# Altium project PlacaCircuito.PrjPCB
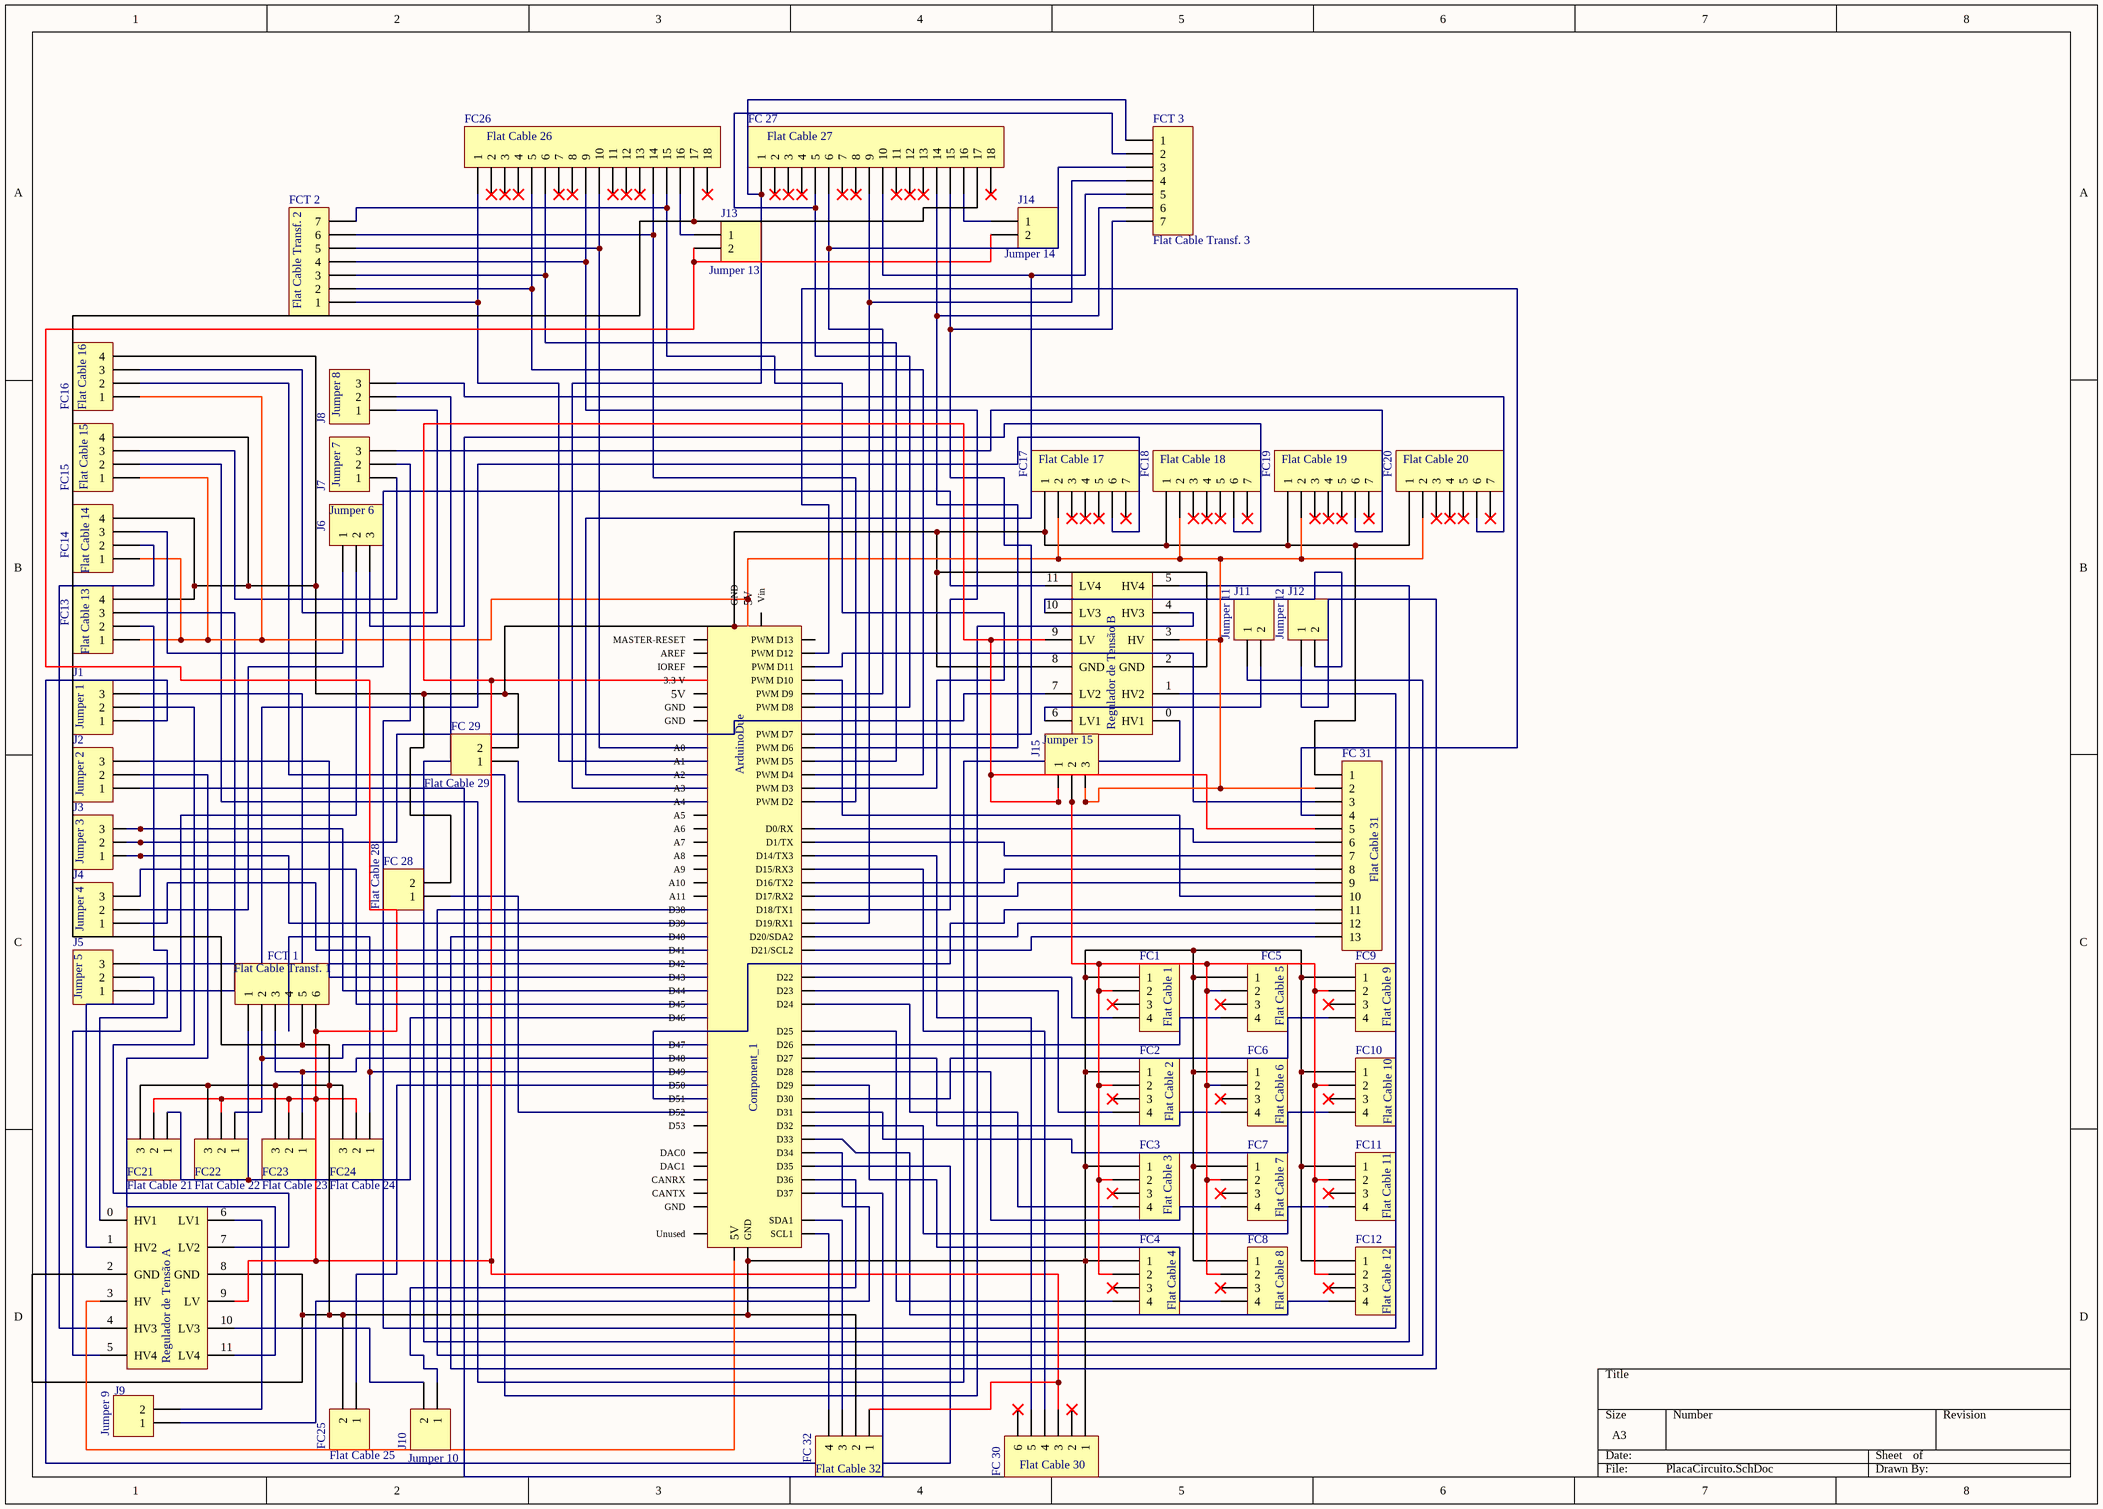
[diagram p0: PlacaCircuito.SchDoc]
1 sheet, 53 parts. Net scope: global (net labels, ports and power ports of the same name join across sheets).
Board file: PlacaCircuito.PcbDoc

## Sheet PlacaCircuito.SchDoc
size A3; PageSetup: Record=PageOptions|CenterHorizontal=True|CenterVertical=True|PrintScale=1.00|XCorrection=1.00|YCorrection=1.00|PrintKind=1|BorderSize=5000000|LeftOffset=0|BottomOffset=0|Orientation=2|PaperLength=1000|PaperWidth=1000|Scale=100|PaperSource=7|PrintQuality=-4|MediaType=1|DitherType=10|PaperKind=A3|PrintScaleMode=1

### Parts
ArduinoDue  Component_1  [Arduino]
FC1  Flat Cable 1  [HDR1X4]
FC2  Flat Cable 2  [HDR1X4]
FC3  Flat Cable 3  [HDR1X4]
FC4  Flat Cable 4  [HDR1X4]
FC5  Flat Cable 5  [HDR1X4]
FC6  Flat Cable 6  [HDR1X4]
FC7  Flat Cable 7  [HDR1X4]
FC8  Flat Cable 8  [HDR1X4]
FC9  Flat Cable 9  [HDR1X4]
FC10  Flat Cable 10  [HDR1X4]
FC11  Flat Cable 11  [HDR1X4]
FC12  Flat Cable 12  [HDR1X4]
FC13  Flat Cable 13  [HDR1X4]
FC14  Flat Cable 14  [HDR1X4]
FC15  Flat Cable 15  [HDR1X4]
FC16  Flat Cable 16  [HDR1X4]
FC17  Flat Cable 17  [HDR1X7]
FC18  Flat Cable 18  [HDR1X7]
FC19  Flat Cable 19  [HDR1X7]
FC20  Flat Cable 20  [HDR1X7]
FC21  Flat Cable 21  [HDR1X3]
FC22  Flat Cable 22  [HDR1X3]
FC23  Flat Cable 23  [HDR1X3]
FC24  Flat Cable 24  [HDR1X3]
FC25  Flat Cable 25  [HDR1X2]
FC26  Flat Cable 26  [HDR1X18]
FC_27  Flat Cable 27  [HDR1X18]
FC_28  Flat Cable 28  [HDR1X2]
FC_29  Flat Cable 29  [HDR1X2]
FC_30  Flat Cable 30  [HDR1X6]
FC_31  Flat Cable 31  [HDR1X13]
FC_32  Flat Cable 32  [HDR1X4]
FCT_1  Flat Cable Transf. 1  [HDR1X6]
FCT_2  Flat Cable Transf. 2  [HDR1X7]
FCT_3  Flat Cable Transf. 3  [HDR1X7]
J1  Jumper 1  [HDR1X3]
J2  Jumper 2  [HDR1X3]
J3  Jumper 3  [HDR1X3]
J4  Jumper 4  [HDR1X3]
J5  Jumper 5  [HDR1X3]
J6  Jumper 6  [HDR1X3]
J7  Jumper 7  [HDR1X3]
J8  Jumper 8  [HDR1X3]
J9  Jumper 9  [HDR1X2]
J10  Jumper 10  [HDR1X2]
J11  Jumper 11  [HDR1X2]
J12  Jumper 12  [HDR1X2]
J13  Jumper 13  [HDR1X2]
J14  Jumper 14  [HDR1X2]
J15  Jumper 15  [HDR1X3]
Regulador_de_Tensão_A  Regulador de Tensão A  [PCBComponent_1]
Regulador_de_Tensão_B  Regulador de Tensão B  [PCBComponent_1]

### Nets
NetArduinoDue_0: ArduinoDue.0(D0/RX) FC_31.6
NetArduinoDue_1: ArduinoDue.1(D1/TX) FC_31.7
NetArduinoDue_2: ArduinoDue.2(PWM_D2) FC26.14 FCT_2.6
NetArduinoDue_3: ArduinoDue.3(PWM_D3) FC26.15 FCT_2.7
NetArduinoDue_4: ArduinoDue.4(PWM_D4) FC26.5 FCT_2.2
NetArduinoDue_5: ArduinoDue.5(PWM_D5) FC26.6 FCT_2.3
NetArduinoDue_6: ArduinoDue.6(PWM_D6) FC_27.14 FCT_3.6
NetArduinoDue_7: ArduinoDue.7(PWM_D7) FC_27.15 FCT_3.7
NetArduinoDue_8: ArduinoDue.8(PWM_D8) FC_27.5 FCT_3.2
NetArduinoDue_9: ArduinoDue.9(PWM_D9) FC_27.6 FCT_3.3
NetArduinoDue_10: ArduinoDue.10(PWM_D10) FC_31.10
NetArduinoDue_11: ArduinoDue.11(PWM_D11) FC_31.3
NetArduinoDue_12: ArduinoDue.12(PWM_D12) FC_31.4
NetArduinoDue_14: ArduinoDue.14(D14/TX3) FC_30.5
NetArduinoDue_15: ArduinoDue.15(D15/RX3) FC_30.4
NetArduinoDue_16: ArduinoDue.16(D16/TX2) FC_31.8
NetArduinoDue_17: ArduinoDue.17(D17/RX2) FC_31.9
NetArduinoDue_18: ArduinoDue.18(D18/TX1) FC26.9 FCT_2.4
NetArduinoDue_19: ArduinoDue.19(D19/RX1) FC_27.9 FCT_3.4
NetArduinoDue_20: ArduinoDue.20(D20/SDA2) FC_31.12
NetArduinoDue_21: ArduinoDue.21(D21/SCL2) FC_31.13
NetArduinoDue_22: ArduinoDue.22(D22) FC1.4
NetArduinoDue_23: ArduinoDue.23(D23) FC2.4
NetArduinoDue_24: ArduinoDue.24(D24) FC3.4
NetArduinoDue_25: ArduinoDue.25(D25) FC4.4
NetArduinoDue_26: ArduinoDue.26(D26) FC5.4
NetArduinoDue_27: ArduinoDue.27(D27) FC6.4
NetArduinoDue_28: ArduinoDue.28(D28) FC7.4
NetArduinoDue_29: ArduinoDue.29(D29) FC8.4
NetArduinoDue_30: ArduinoDue.30(D30) FC9.4
NetArduinoDue_31: ArduinoDue.31(D31) FC10.4
NetArduinoDue_32: ArduinoDue.32(D32) FC11.4
NetArduinoDue_33: ArduinoDue.33(D33) FC12.4
NetArduinoDue_34: ArduinoDue.34(D34) J9.1
NetArduinoDue_35: ArduinoDue.35(D35) J1.1
NetArduinoDue_36: ArduinoDue.36(D36) J10.1
NetArduinoDue_37: ArduinoDue.37(D37) J2.1
NetArduinoDue_38: ArduinoDue.38(D38) J11.1
NetArduinoDue_39: ArduinoDue.39(D39) J3.1
NetArduinoDue_40: ArduinoDue.40(D40) J12.1
NetArduinoDue_41: ArduinoDue.41(D41) J4.1
NetArduinoDue_42: ArduinoDue.42(D42) J1.3
NetArduinoDue_43: ArduinoDue.43(D43) J2.3
NetArduinoDue_44: ArduinoDue.44(D44) J3.3
NetArduinoDue_45: ArduinoDue.45(D45) J4.3
NetArduinoDue_46: ArduinoDue.46(D46) FC21.1 FCT_1.1
NetArduinoDue_47: ArduinoDue.47(D47) FC22.1 FCT_1.2
NetArduinoDue_48: ArduinoDue.48(D48) FC23.1 FCT_1.3
NetArduinoDue_49: ArduinoDue.49(D49) FC24.1 FCT_1.4
NetArduinoDue_50: ArduinoDue.50(D50) FC25.1
NetArduinoDue_51: ArduinoDue.51(D51) FC_31.11
NetArduinoDue_52: ArduinoDue.52(D52) FC_28.1
NetArduinoDue_55: ArduinoDue.55(3.3_V) FC21.2 FC22.2 FC23.2 FC24.2 FC_30.3 FC_31.5 FC_32.1 FCT_1.6 J13.2 J14.2 J15.1 Regulador_de_Tensão_A.9(LV) Regulador_de_Tensão_B.9(LV)
NetArduinoDue_56: ArduinoDue.56(5V) Regulador_de_Tensão_A.3(HV)
NetArduinoDue_58: ArduinoDue.58(GND) FC1.1 FC2.1 FC3.1 FC4.1 FC5.1 FC6.1 FC7.1 FC8.1 FC9.1 FC10.1 FC11.1 FC12.1 FC21.3 FC22.3 FC23.3 FC24.3 FC25.2 FC26.17 FC_27.17 FC_30.1 FC_32.2 FCT_1.5 Regulador_de_Tensão_A.2(GND) Regulador_de_Tensão_A.8(GND)
NetArduinoDue_60: ArduinoDue.60(A0) FC26.10 FCT_2.5
NetArduinoDue_61: ArduinoDue.61(A1) FC26.1 FCT_2.1
NetArduinoDue_62: ArduinoDue.62(A2) FC_27.10 FCT_3.5
NetArduinoDue_63: ArduinoDue.63(A3) FC_27.1 FCT_3.1
NetArduinoDue_64: ArduinoDue.64(A4) FC_29.1
NetArduinoDue_76: ArduinoDue.76(GND) FC13.4 FC14.4 FC15.4 FC16.4 FC17.1 FC18.1 FC19.1 FC20.1 FC_28.2 FC_29.2 FC_31.1 Regulador_de_Tensão_B.2(GND) Regulador_de_Tensão_B.8(GND)
NetArduinoDue_81: ArduinoDue.81(5V) FC13.1 FC14.1 FC15.1 FC16.1 FC17.2 FC18.2 FC19.2 FC20.2 FC_31.2 J15.3 Regulador_de_Tensão_B.3(HV)
NetArduinoDue_82: ArduinoDue.82(SDA1) FC_32.3
NetArduinoDue_83: ArduinoDue.83(SCL1) FC_32.4
NetFC1_2: FC1.2 FC2.2 FC3.2 FC4.2 FC5.2 FC6.2 FC7.2 FC8.2 FC9.2 FC10.2 FC11.2 FC12.2 J15.2
NetFC13_2: FC13.2 Regulador_de_Tensão_A.0(HV1)
NetFC13_3: FC13.3 J5.1
NetFC14_2: FC14.2 Regulador_de_Tensão_A.4(HV3)
NetFC14_3: FC14.3 J6.1
NetFC15_2: FC15.2 Regulador_de_Tensão_B.0(HV1)
NetFC15_3: FC15.3 J7.1
NetFC16_2: FC16.2 Regulador_de_Tensão_B.4(HV3)
NetFC16_3: FC16.3 J8.1
NetFC17_6: FC17.6 J5.3
NetFC18_6: FC18.6 J6.3
NetFC19_6: FC19.6 J7.3
NetFC20_6: FC20.6 J8.3
NetFC26_16: FC26.16 J13.1
NetFC_27_16: FC_27.16 J14.1
NetJ1_2: J1.2 Regulador_de_Tensão_A.7(LV2)
NetJ2_2: J2.2 Regulador_de_Tensão_A.11(LV4)
NetJ3_2: J3.2 Regulador_de_Tensão_B.7(LV2)
NetJ4_2: J4.2 Regulador_de_Tensão_B.11(LV4)
NetJ5_2: J5.2 Regulador_de_Tensão_A.1(HV2)
NetJ6_2: J6.2 Regulador_de_Tensão_A.5(HV4)
NetJ7_2: J7.2 Regulador_de_Tensão_B.1(HV2)
NetJ8_2: J8.2 Regulador_de_Tensão_B.5(HV4)
NetJ9_2: J9.2 Regulador_de_Tensão_A.6(LV1)
NetJ10_2: J10.2 Regulador_de_Tensão_A.10(LV3)
NetJ11_2: J11.2 Regulador_de_Tensão_B.6(LV1)
NetJ12_2: J12.2 Regulador_de_Tensão_B.10(LV3)

Not connected (* = marked no-connect by the designer): ArduinoDue 13(PWM_D13) 53(D53) 54(MASTER-RESET) 57(GND) 59(Vin) 65(A5) 66(A6) 67(A7) 68(A8) 69(A9) 70(A10) 71(A11) 72(DAC0) 73(DAC1) 74(CANRX) 75(CANTX) 77(AREF) 78(GND) 79(GND) 80(5V) 84(IOREF) 85(Unused); FC1 3*; FC2 3*; FC3 3*; FC4 3*; FC5 3*; FC6 3*; FC7 3*; FC8 3*; FC9 3*; FC10 3*; FC11 3*; FC12 3*; FC17 3* 4* 5* 7*; FC18 3* 4* 5* 7*; FC19 3* 4* 5* 7*; FC20 3* 4* 5* 7*; FC26 2* 3* 4* 7* 8* 11* 12* 13* 18*; FC_27 2* 3* 4* 7* 8* 11* 12* 13* 18*; FC_30 2* 6*

### Library data of the parts
ArduinoDue = Component_1: Arduino Due Board
FC1-FC16 FC_32 = Header 4: Header, 4-Pin; LatestRevisionDate: 17-Jul-2002; LatestRevisionNote: Re-released for DXP Platform.; Publisher: Altium Limited
FC17-FC20 FCT_2 FCT_3 = Header 7: Header, 7-Pin; LatestRevisionDate: 17-Jul-2002; LatestRevisionNote: Re-released for DXP Platform.; Publisher: Altium Limited
FC21-FC24 J1-J8 J15 = Header 3: Header, 3-Pin; LatestRevisionDate: 17-Jul-2002; LatestRevisionNote: Re-released for DXP Platform.; Publisher: Altium Limited
FC25 FC_28 FC_29 J9-J14 = Header 2: Header, 2-Pin; LatestRevisionDate: 17-Jul-2002; LatestRevisionNote: Re-released for DXP Platform.; Publisher: Altium Limited
FC26 FC_27 = Header 18: Header, 18-Pin; LatestRevisionDate: 17-Jul-2002; LatestRevisionNote: Re-released for DXP Platform.; Publisher: Altium Limited
FC_30 FCT_1 = Header 6: Header, 6-Pin; LatestRevisionDate: 17-Jul-2002; LatestRevisionNote: Re-released for DXP Platform.; Publisher: Altium Limited
FC_31 = Header 13: Header, 13-Pin; LatestRevisionDate: 17-Jul-2002; LatestRevisionNote: Re-released for DXP Platform.; Publisher: Altium Limited
Regulador_de_Tensão_A Regulador_de_Tensão_B = Component_1